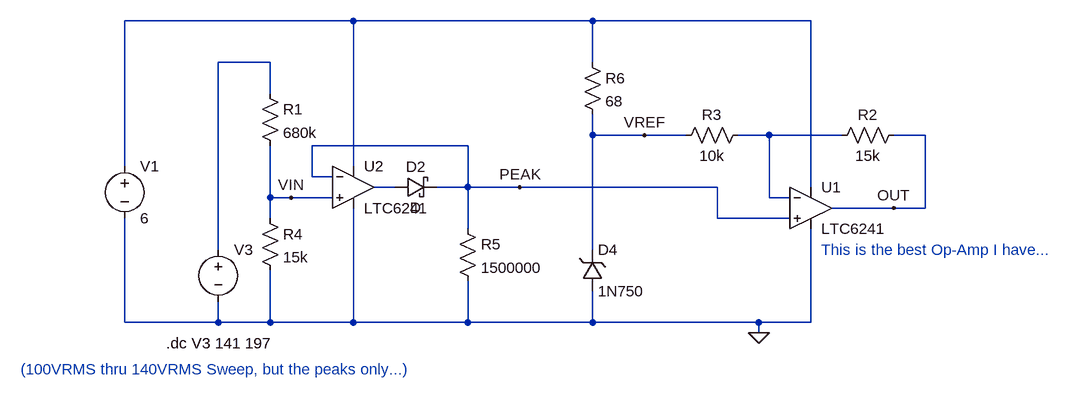
[diagram p0: schematic Voltage_Offset_Circuit.asc]
Voltage_Offset_Circuit.asc, the LTspice schematic file:
Version 4
SHEET 1 880 680
WIRE -544 -272 -896 -272
WIRE -176 -272 -544 -272
WIRE 160 -272 -176 -272
WIRE -672 -208 -752 -208
WIRE -176 -208 -176 -272
WIRE -672 -160 -672 -208
WIRE -176 -96 -176 -128
WIRE -96 -96 -176 -96
WIRE -32 -96 -96 -96
WIRE 96 -96 48 -96
WIRE 208 -96 96 -96
WIRE 336 -96 288 -96
WIRE -368 -80 -608 -80
WIRE -896 -48 -896 -272
WIRE -544 -48 -544 -272
WIRE -608 -32 -608 -80
WIRE -576 -32 -608 -32
WIRE -480 -16 -512 -16
WIRE -368 -16 -368 -80
WIRE -368 -16 -416 -16
WIRE -288 -16 -368 -16
WIRE 16 -16 -288 -16
WIRE 160 -16 160 -272
WIRE -672 0 -672 -80
WIRE -640 0 -672 0
WIRE -576 0 -640 0
WIRE 96 0 96 -96
WIRE 128 0 96 0
WIRE 288 16 192 16
WIRE 336 16 336 -96
WIRE 336 16 288 16
WIRE -672 32 -672 0
WIRE 16 32 16 -16
WIRE 128 32 16 32
WIRE -368 48 -368 -16
WIRE -752 80 -752 -208
WIRE -176 80 -176 -96
WIRE -896 192 -896 32
WIRE -752 192 -752 160
WIRE -752 192 -896 192
WIRE -672 192 -672 112
WIRE -672 192 -752 192
WIRE -544 192 -544 16
WIRE -544 192 -672 192
WIRE -368 192 -368 128
WIRE -368 192 -544 192
WIRE -176 192 -176 144
WIRE -176 192 -368 192
WIRE 80 192 -176 192
WIRE 160 192 160 48
WIRE 160 192 80 192
WIRE 80 208 80 192
FLAG 80 208 0
FLAG 288 16 OUT
FLAG -640 0 VIN
FLAG -96 -96 VREF
FLAG -288 -16 PEAK
SYMBOL res 304 -112 R90
WINDOW 0 0 56 VBottom 2
WINDOW 3 32 56 VTop 2
SYMATTR InstName R2
SYMATTR Value 15k
SYMBOL res 64 -112 R90
WINDOW 0 0 56 VBottom 2
WINDOW 3 32 56 VTop 2
SYMATTR InstName R3
SYMATTR Value 10k
SYMBOL voltage -896 -64 R0
WINDOW 123 0 0 Left 0
WINDOW 39 0 0 Left 0
SYMATTR InstName V1
SYMATTR Value 6
SYMBOL OpAmps\\LTC6241 160 16 R0
SYMATTR InstName U1
SYMBOL voltage -752 64 R0
WINDOW 3 -213 109 Left 2
WINDOW 123 0 0 Left 0
WINDOW 39 0 0 Left 0
SYMATTR Value ""
SYMATTR InstName V3
SYMBOL res -688 -176 R0
SYMATTR InstName R1
SYMATTR Value 680k
SYMBOL res -688 16 R0
SYMATTR InstName R4
SYMATTR Value 15k
SYMBOL OpAmps\\LTC6241 -544 -16 R0
SYMATTR InstName U2
SYMBOL schottky -480 0 R270
WINDOW 0 32 32 VTop 2
WINDOW 3 0 32 VBottom 2
SYMATTR InstName D2
SYMBOL res -384 32 R0
SYMATTR InstName R5
SYMATTR Value 1500000
SYMBOL res -192 -224 R0
SYMATTR InstName R6
SYMATTR Value 68
SYMBOL zener -192 144 M180
WINDOW 0 24 64 Left 2
WINDOW 3 24 0 Left 2
SYMATTR InstName D4
SYMATTR Value 1N750
TEXT 176 80 Left 2 ;This is the best Op-Amp I have...
TEXT -832 224 Left 2 !.dc V3 141 197
TEXT -1056 264 Left 2 ;(100VRMS thru 140VRMS Sweep, but the peaks only...)

The netlist it stands for:
* Voltage_Offset_Circuit.asc
R2 OUT N003 15k
R3 N003 VREF 10k
V1 N001 0 6
XU1 PEAK N003 N001 0 OUT LTC6241  ; pins In+ In- V+ V- OUT
V3 N002 0
R1 N002 VIN 680k
R4 VIN 0 15k
XU2 VIN PEAK N001 0 N004 LTC6241  ; pins In+ In- V+ V- OUT
D2 N004 PEAK D
R5 PEAK 0 1500000
R6 N001 VREF 68
D4 0 VREF 1N750
.model D D
.lib standard.dio
* This is the best Op-Amp I have...
.dc V3 141 197
* (100VRMS thru 140VRMS Sweep, but the peaks only...)
.lib LTC4.lib
.backanno
.end